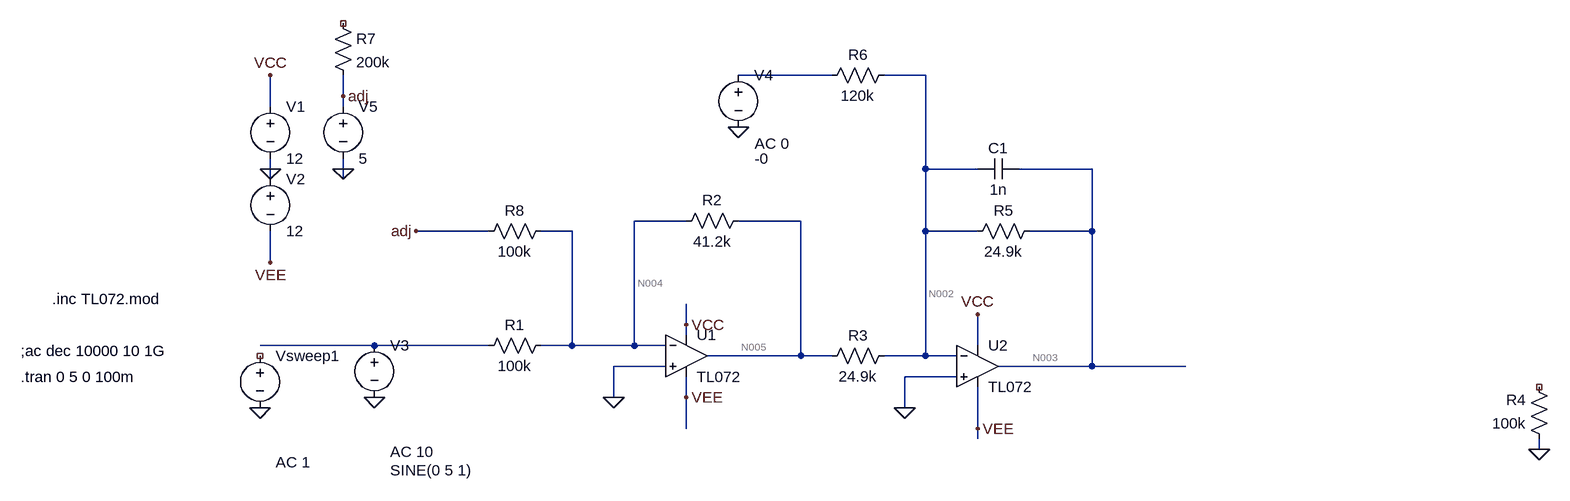
[diagram p0: schematic FM_in.asc]
FM_in.asc, the LTspice schematic file:
Version 4
SHEET 1 1540 680
WIRE 432 -272 288 -272
WIRE 576 -272 512 -272
WIRE -320 -240 -320 -272
WIRE -432 -224 -432 -272
WIRE -320 -224 -320 -240
WIRE -432 -128 -432 -144
WIRE -320 -128 -320 -144
WIRE 576 -128 576 -272
WIRE 656 -128 576 -128
WIRE 832 -128 720 -128
WIRE -432 -112 -432 -128
WIRE -320 -112 -320 -128
WIRE 208 -48 128 -48
WIRE 384 -48 288 -48
WIRE -96 -32 -208 -32
WIRE 32 -32 -16 -32
WIRE 576 -32 576 -128
WIRE 656 -32 576 -32
WIRE 832 -32 832 -128
WIRE 832 -32 736 -32
WIRE -432 16 -432 -32
WIRE 208 112 208 80
WIRE 208 128 208 112
WIRE -272 144 -448 144
WIRE -96 144 -272 144
WIRE 32 144 32 -32
WIRE 32 144 -16 144
WIRE 128 144 128 -48
WIRE 128 144 32 144
WIRE 176 144 128 144
WIRE 656 144 656 96
WIRE 384 160 384 -48
WIRE 384 160 240 160
WIRE 432 160 384 160
WIRE 576 160 576 -32
WIRE 576 160 512 160
WIRE 624 160 576 160
WIRE 176 176 96 176
WIRE 832 176 832 -32
WIRE 832 176 688 176
WIRE 976 176 832 176
WIRE 624 192 544 192
WIRE 96 224 96 176
WIRE 208 224 208 192
WIRE 544 240 544 192
WIRE 208 272 208 224
WIRE 656 272 656 208
WIRE 656 288 656 272
WIRE 1520 304 1520 288
FLAG -432 -128 0
FLAG -432 -272 VCC
FLAG -432 16 VEE
FLAG 208 112 VCC
FLAG 208 224 VEE
FLAG 96 224 0
FLAG -448 240 0
FLAG -272 224 0
FLAG 1520 304 0
FLAG 544 240 0
FLAG 288 -192 0
FLAG -320 -128 0
FLAG 656 272 VEE
FLAG 656 96 VCC
FLAG -320 -240 adj
FLAG -208 -32 adj
SYMBOL Opamps\\opamp2 208 96 R0
SYMATTR InstName U1
SYMATTR Value TL072
SYMBOL voltage -432 -240 R0
WINDOW 123 0 0 Left 0
WINDOW 39 0 0 Left 0
SYMATTR InstName V1
SYMATTR Value 12
SYMBOL voltage -432 -128 R0
WINDOW 123 0 0 Left 0
WINDOW 39 0 0 Left 0
SYMATTR InstName V2
SYMATTR Value 12
SYMBOL res 0 128 R90
WINDOW 0 0 56 VBottom 2
WINDOW 3 32 56 VTop 2
SYMATTR InstName R1
SYMATTR Value 100k
SYMBOL res 304 -64 R90
WINDOW 0 0 56 VBottom 2
WINDOW 3 32 56 VTop 2
SYMATTR InstName R2
SYMATTR Value 41.2k
SYMBOL voltage -448 144 R0
WINDOW 3 24 152 Left 2
WINDOW 123 24 180 Left 2
WINDOW 39 0 0 Left 0
SYMATTR Value ""
SYMATTR Value2 AC 1
SYMATTR InstName Vsweep1
SYMBOL voltage -272 128 R0
WINDOW 3 24 208 Left 2
WINDOW 123 24 180 Left 2
WINDOW 39 0 0 Left 0
SYMATTR Value SINE(0 5 1)
SYMATTR Value2 AC 10
SYMATTR InstName V3
SYMBOL res 1536 304 R180
WINDOW 0 36 76 Left 2
WINDOW 3 36 40 Left 2
SYMATTR InstName R4
SYMATTR Value 100k
SYMBOL res 528 144 R90
WINDOW 0 0 56 VBottom 2
WINDOW 3 32 56 VTop 2
SYMATTR InstName R3
SYMATTR Value 24.9k
SYMBOL res 752 -48 R90
WINDOW 0 0 56 VBottom 2
WINDOW 3 32 56 VTop 2
SYMATTR InstName R5
SYMATTR Value 24.9k
SYMBOL voltage 288 -288 R0
WINDOW 3 25 144 Left 2
WINDOW 123 25 121 Left 2
WINDOW 39 0 0 Left 0
SYMATTR Value -0
SYMATTR Value2 AC 0
SYMATTR InstName V4
SYMBOL res 528 -288 R90
WINDOW 0 0 56 VBottom 2
WINDOW 3 32 56 VTop 2
SYMATTR InstName R6
SYMATTR Value 120k
SYMBOL cap 720 -144 R90
WINDOW 0 0 32 VBottom 2
WINDOW 3 32 32 VTop 2
SYMATTR InstName C1
SYMATTR Value 1n
SYMBOL voltage -320 -240 R0
WINDOW 123 0 0 Left 0
WINDOW 39 0 0 Left 0
SYMATTR InstName V5
SYMATTR Value 5
SYMBOL Opamps\\opamp2 656 112 R0
SYMATTR InstName U2
SYMATTR Value TL072
SYMBOL res -336 -368 R0
SYMATTR InstName R7
SYMATTR Value 200k
SYMBOL res 0 -48 R90
WINDOW 0 0 56 VBottom 2
WINDOW 3 32 56 VTop 2
SYMATTR InstName R8
SYMATTR Value 100k
TEXT -768 72 Left 2 !.inc TL072.mod
TEXT -816 152 Left 2 !;ac dec 10000 10 1G
TEXT -816 192 Left 2 !.tran 0 5 0 100m

The netlist it stands for:
* FM_in.asc
XU1 0 N004 VCC VEE N005 TL072  ; pins In+ In- V+ V- OUT
V1 VCC 0 12
V2 0 VEE 12
R1 N004 N006 100k
R2 N005 N004 41.2k
Vsweep1 NC_01 0 AC 1
V3 N006 0 SINE(0 5 1) AC 10
R4 0 NC_02 100k
R3 N002 N005 24.9k
R5 N003 N002 24.9k
V4 N001 0 -0 AC 0
R6 N002 N001 120k
C1 N003 N002 1n
V5 adj 0 5
XU2 0 N002 VCC VEE N003 TL072  ; pins In+ In- V+ V- OUT
R7 NC_03 adj 200k
R8 N004 adj 100k
.inc TL072.mod
;ac dec 10000 10 1G
.tran 0 5 0 100m
.backanno
.end

* Results of the author's LTspice run, read from the files saved beside the schematic
* Operating Point, zero values left out:
*   V(n005) = -2.06 V
*   V(vee) = -12 V
*   V(vcc) = 12 V
*   V(n004) = 20.12 µV
*   V(n002) = 1.883 µV
*   V(n003) = 2.06 V
*   V(adj) = 5 V
*   I(R8) = -50 µA
*   I(R6) = 15.7 pA
*   I(R5) = 82.73 µA
*   I(R3) = 82.73 µA
*   I(R2) = -50 µA
*   I(R1) = 201.2 pA
*   I(V5) = -50 µA
*   I(V4) = 15.7 pA
*   I(V3) = 201.2 pA
*   I(V2) = -22.79 mA
*   I(V1) = -22.79 mA
*   Ix(u1:1) = 42.05 pA
*   Ix(u1:2) = 42.05 pA
*   Ix(u1:3) = 11.39 mA
*   Ix(u1:4) = -11.39 mA
*   Ix(u1:5) = 132.7 µA
*   Ix(u2:1) = 42.05 pA
*   Ix(u2:2) = 42.05 pA
*   Ix(u2:3) = 11.39 mA
*   Ix(u2:4) = -11.39 mA
*   Ix(u2:5) = -82.73 µA
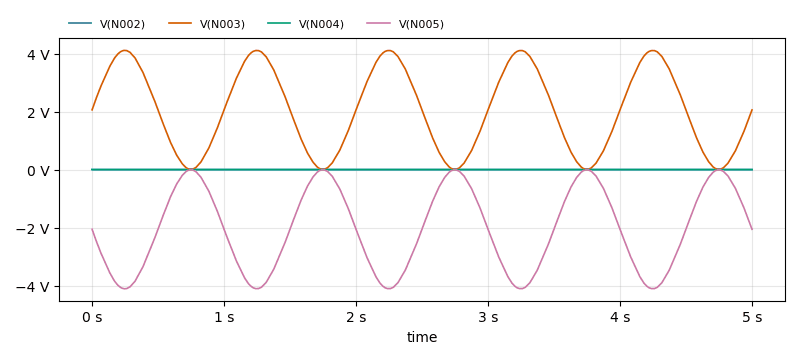
[diagram p1: Transient Analysis of FM_in.asc, plotted from the saved traces]
* Transient Analysis, 1 run:
*   V(N002): min -7.192 µV, max 10.96 µV, average 1.902 µV, rms 6.66 µV, last 1.238 µV
*   V(N003): min 7.484 mV, max 4.114 V, average 2.056 V, rms 2.511 V, last 2.06 V
*   V(N004): min 10.98 µV, max 29.26 µV, average 20.1 µV, rms 21.11 µV, last 20.78 µV
*   V(N005): min -4.114 V, max -7.45 mV, average -2.056 V, rms 2.511 V, last -2.06 V